# EAGLE design Schematc automa contatore (EAGLE 9.6.2)
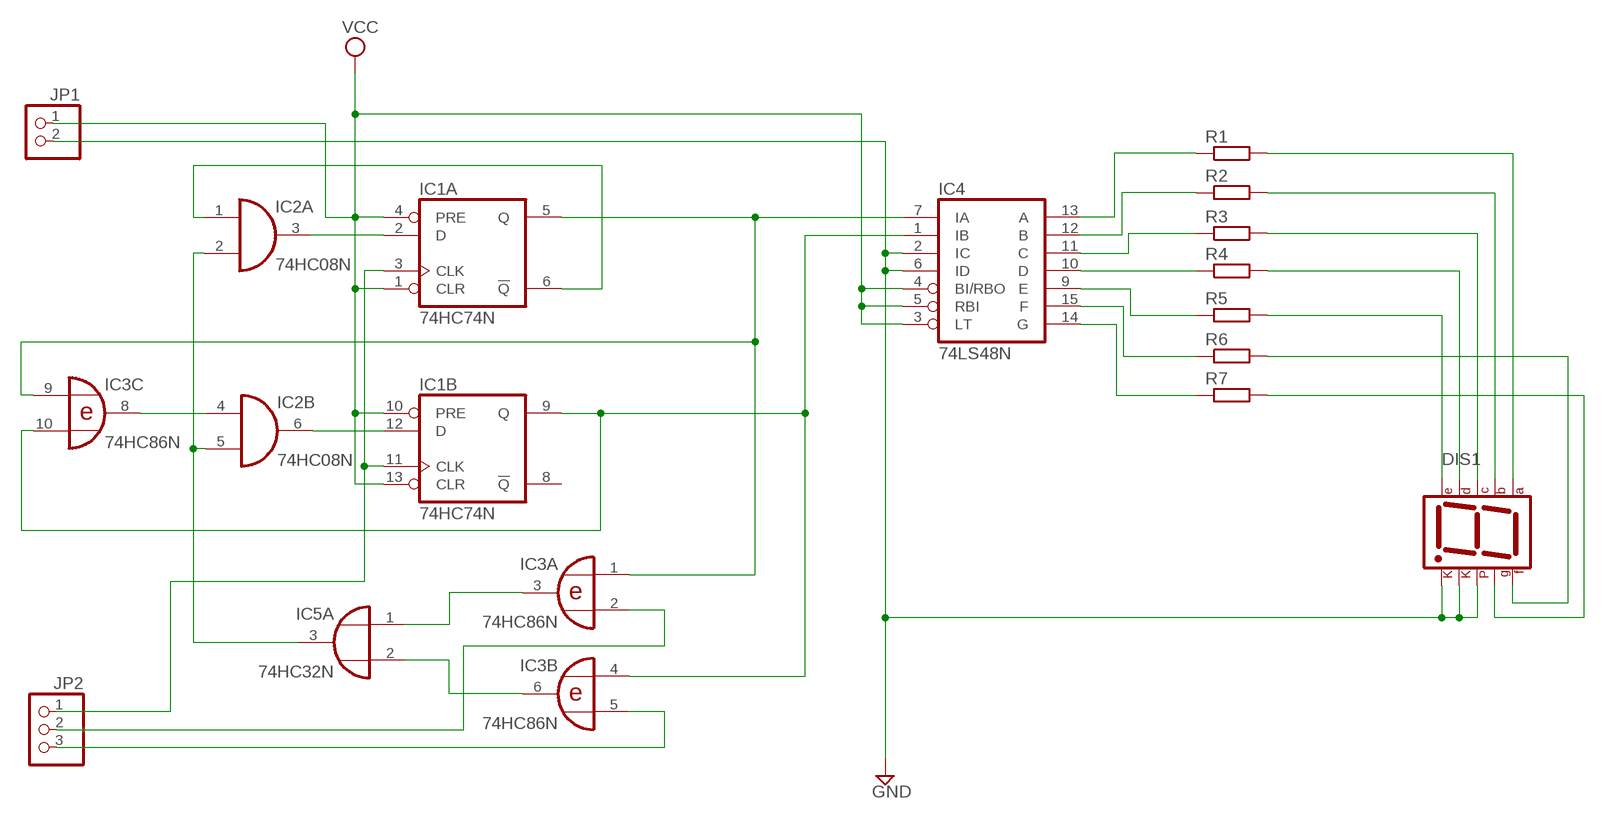
[diagram p0: schematic, sheet 1]

## Parts
DIS1  7SEG-CK  [7SEG-13]
IC1  74HC74N  [DIL14]
IC2  74HC08N  [DIL14]
IC3  74HC86N  [DIL14]
IC4  74LS48N  [DIL16]
IC5  74HC32N  [DIL14]
JP1  PINHD-1X2  [1X02]
JP2  PINHD-1X3  [1X03]
R1  R-EU_0204/5  [0204/5]
R2  R-EU_0204/5  [0204/5]
R3  R-EU_0204/5  [0204/5]
R4  R-EU_0204/5  [0204/5]
R5  R-EU_0204/5  [0204/5]
R6  R-EU_0204/5  [0204/5]
R7  R-EU_0204/5  [0204/5]

## Nets
GND: DIS1.3(CK1) DIS1.5(DP) DIS1.8(CK2) IC4.2(IC) IC4.6(ID) JP1.2
N$1: IC1.5(A:Q) IC3.1(A:I0) IC3.9(C:I0) IC4.7(IA)
N$2: IC1.9(B:Q) IC3.4(B:I0) IC3.10(C:I1) IC4.1(IB)
N$3: IC1.2(A:D) IC2.3(A:O)
N$4: IC1.12(B:D) IC2.6(B:O)
N$5: IC1.6(A:!Q) IC2.1(A:I0)
N$6: IC2.4(B:I0) IC3.8(C:O)
N$7: IC3.3(A:O) IC5.1(A:I0)
N$8: IC3.6(B:O) IC5.2(A:I1)
N$9: IC2.2(A:I1) IC2.5(B:I1) IC5.3(A:O)
N$10: IC1.3(A:CLK) IC1.11(B:CLK) JP2.1
N$11: IC3.2(A:I1) JP2.2
N$12: IC3.5(B:I1) JP2.3
N$13: IC4.13(A) R1.1
N$14: IC4.12(B) R2.1
N$15: IC4.11(C) R3.1
N$16: IC4.10(D) R4.1
N$17: IC4.9(E) R5.1
N$18: IC4.15(F) R6.1
N$19: IC4.14(G) R7.1
N$20: DIS1.7(A) R1.2
N$21: DIS1.6(B) R2.2
N$22: DIS1.4(C) R3.2
N$23: DIS1.2(D) R4.2
N$24: DIS1.1(E) R5.2
N$25: DIS1.9(F) R6.2
N$26: DIS1.10(G) R7.2
VCC: IC1.1(A:CLR) IC1.4(A:PRE) IC1.10(B:PRE) IC1.13(B:CLR) IC4.3(LT) IC4.4(BI/RBO) IC4.5(RBI) JP1.1
Unconnected: IC1.8(B:!Q) IC2.8(C:O) IC2.9(C:I0) IC2.10(C:I1) IC2.11(D:O) IC2.12(D:I0) IC2.13(D:I1) IC3.11(D:O) IC3.12(D:I0) IC3.13(D:I1) IC5.4(B:I0) IC5.5(B:I1) IC5.6(B:O) IC5.8(C:O) IC5.9(C:I0) IC5.10(C:I1) IC5.11(D:O) IC5.12(D:I0) IC5.13(D:I1)

## Power pins joined to a net without a drawn wire
GND: IC1.7(P:GND) IC2.7(P:GND) IC3.7(P:GND) IC4.8(GND) IC5.7(P:GND)
VCC: IC1.14(P:VCC) IC2.14(P:VCC) IC3.14(P:VCC) IC4.16(VCC) IC5.14(P:VCC)

## Library data of the parts
DIS1 = special:7SEG-CK: 7-segment DISPLAY single cathode, 13 mm
IC1 = 74xx-eu:74*74: Dual D type positive edge triggered FLIP FLOP, preset and clear
IC2 = 74xx-eu:74*08: Quad 2-input AND gate
IC3 = 74xx-eu:74*86: Quad 2-input EXCLUSIVE-OR (XOR) gate
IC4 = 74xx-eu:74*48: BCD to seven segment DECODER/DRIVER
IC5 = 74xx-eu:74*32: Quad 2-input OR gate
JP1 = pinhead:PINHD-1X2: PIN HEADER
JP2 = pinhead:PINHD-1X3: PIN HEADER
R1-R7 = rcl:R-EU_: RESISTOR, European symbol; SPICEPREFIX: R

## Board
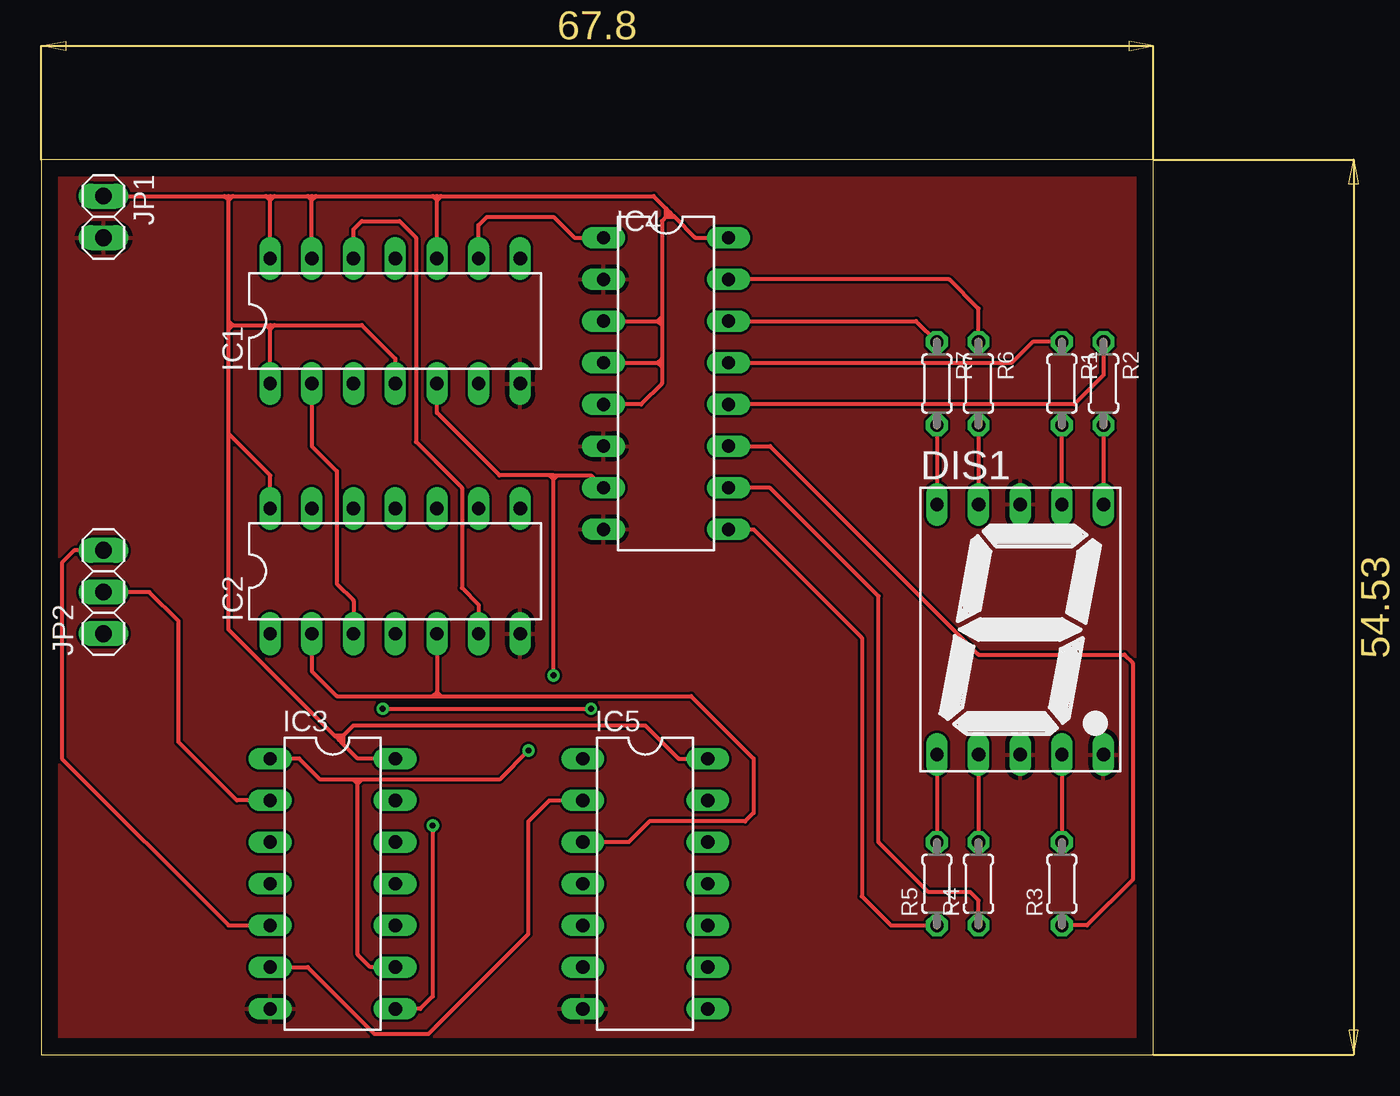
[diagram p1: board, top side]
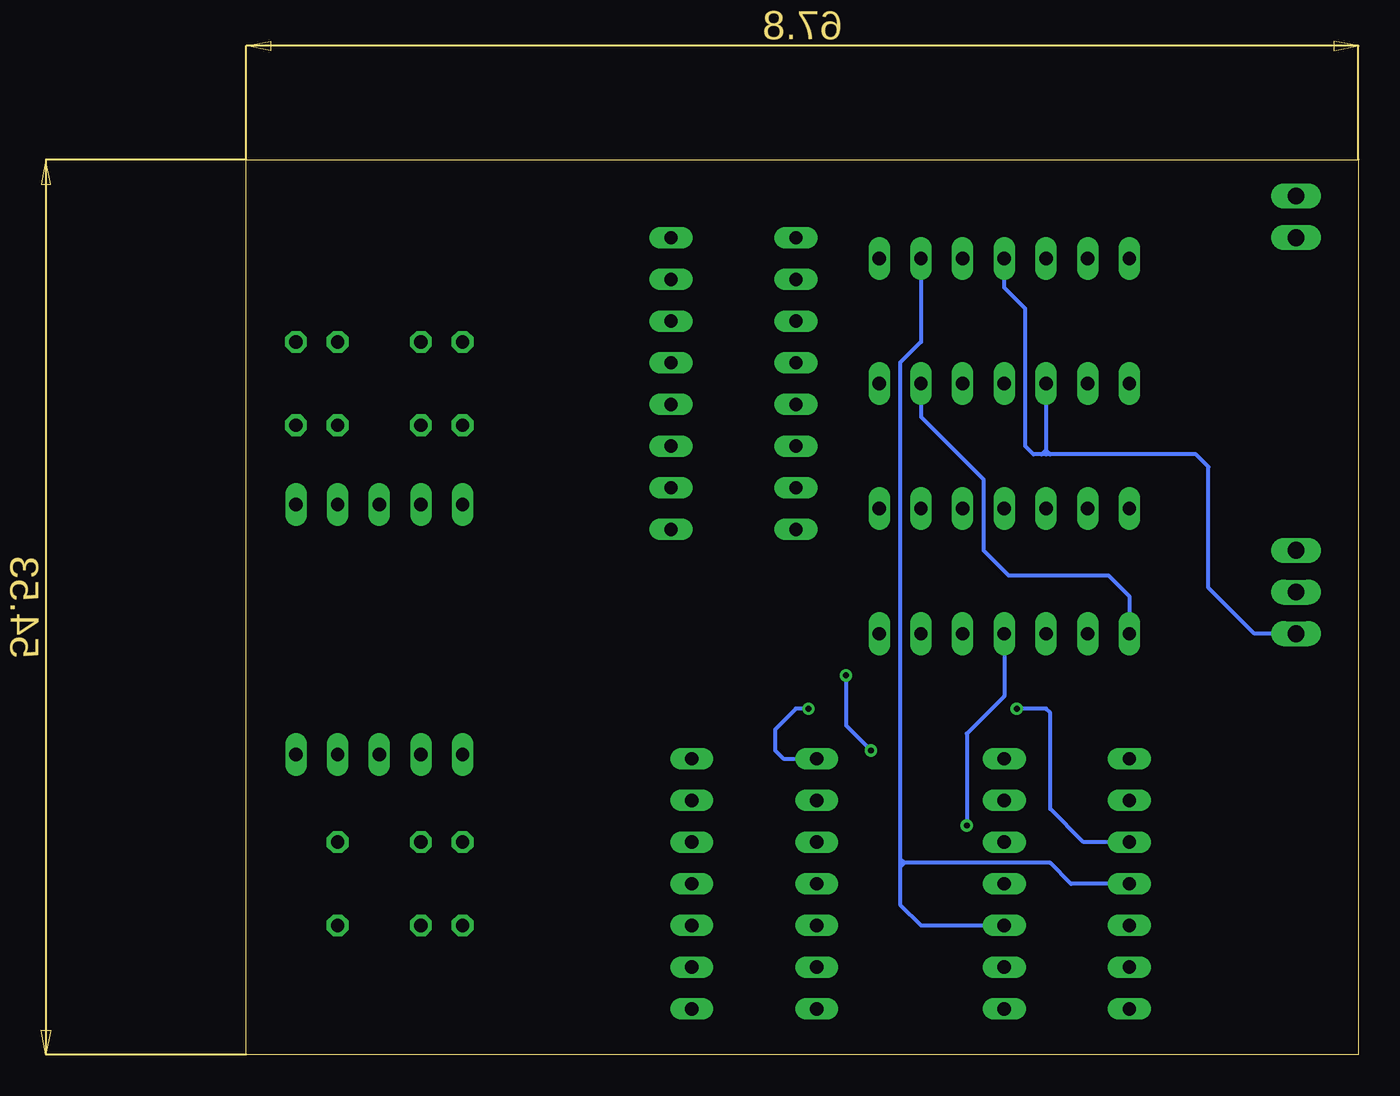
[diagram p2: board, bottom side, seen from below]

Size 67.8 x 54.53 mm. Coordinates in mm from the lower left corner, seen from the top.
Outline: 0,0 67.8,0 67.8,54.53 0,54.53 0,0
Copper layers (1*16): Top 0.035mm / dielectric 1.5mm / Bottom 0.035mm
Design rules "default": minimum track width 6mil, minimum drill 0.35mm, track to track 6mil, track to pad 6mil, pad to pad 6mil, via to via 6mil, smd to smd 6mil, copper to edge 40mil, drill to drill 6mil, minimum pad ring 10mil, minimum via ring 8mil, stop-mask expansion 4mil, vias tented up to drill 0mil, thermal gap 10mil

### Footprints (pad centres in the part's own frame; a part is rotated, then mirrored left to right if it is on the bottom)
7SEG-13 = drill 0.813 long: 1 -5.08,-7.62; 2 -2.54,-7.62; 3 0,-7.62; 4 2.54,-7.62; 5 5.08,-7.62; 6 5.08,7.62; 7 2.54,7.62; 8 0,7.62; 9 -2.54,7.62; 10 -5.08,7.62
DIL14 = drill 0.813 long: 1 -7.62,-3.81; 2 -5.08,-3.81; 3 -2.54,-3.81; 4 0,-3.81; 5 2.54,-3.81; 6 5.08,-3.81; 7 7.62,-3.81; 8 7.62,3.81; 9 5.08,3.81; 10 2.54,3.81; 11 0,3.81; 12 -2.54,3.81; 13 -5.08,3.81; 14 -7.62,3.81
DIL16 = drill 0.813 long: 1 -8.89,-3.81; 2 -6.35,-3.81; 3 -3.81,-3.81; 4 -1.27,-3.81; 5 1.27,-3.81; 6 3.81,-3.81; 7 6.35,-3.81; 8 8.89,-3.81; 9 8.89,3.81; 10 6.35,3.81; 11 3.81,3.81; 12 1.27,3.81; 13 -1.27,3.81; 14 -3.81,3.81; 15 -6.35,3.81; 16 -8.89,3.81
1X02 = drill 1.016 long: 1 -1.27,0; 2 1.27,0
1X03 = drill 1.016 long: 1 -2.54,0; 2 0,0; 3 2.54,0
0204/5 = drill 0.813 octagon: 1 -2.54,0; 2 2.54,0

### Placement (x,y rotation side)
DIS1  59.69,25.91 0 top
IC1  21.59,44.7 0 top
IC2  21.59,29.46 0 top
IC3  17.78,10.41 270 top
IC4  38.1,40.89 270 top
IC5  36.83,10.41 270 top
JP1  3.81,51.05 270 top
JP2  3.81,28.19 90 top
R1  62.23,40.89 270 top
R2  64.77,40.89 270 top
R3  62.23,10.41 90 top
R4  57.15,10.41 90 top
R5  54.61,10.41 90 top
R6  57.15,40.89 270 top
R7  54.61,40.89 270 top

### Tracks (layer width: path | path; a pad name or v marks a point on that pad's centre or on a via)
GND
  pour Top: -1.02,55.37 -1.02,-1.27 69.09,-1.27 69.09,55.37
N$1  (via drill 0.35)
  Top 0.254: 31.24,35.31 30.99,35.31 | 30.99,35.31 27.94,35.31 24.13,39.12 IC1.5 | v31.24,23.11 31.24,35.05 | 31.24,35.31 31.24,35.05 | v29.72,18.54 27.94,16.76 19.56,16.76 | IC3.1 15.75,18.03 17.02,16.76 19.05,16.76 | 19.56,16.76 19.3,16.76 | 19.3,16.76 19.05,16.76 | IC3.9 20.07,5.33 19.3,6.1 19.3,16.51 | 19.3,16.51 19.3,16.76 | 31.24,35.31 31.5,35.31 | 31.5,35.31 33.53,35.31 IC4.7 | 31.24,35.05 30.99,35.31 | 31.24,35.05 31.5,35.31 | 19.3,16.51 19.05,16.76 | 19.3,16.51 19.56,16.76
  Bottom 0.254: v31.24,23.11 31.24,20.07 v29.72,18.54
N$2
  Top 0.254: IC1.9 26.67,50.55 27.18,51.05 31.24,51.05 32.51,49.78 IC4.1
  Bottom 0.254: IC1.9 26.67,43.43 27.94,42.16 27.94,11.94 | 27.94,11.94 27.94,11.68 | 27.94,11.68 27.94,11.43 | 27.94,11.43 27.94,9.14 26.67,7.87 IC3.10 | IC3.4 17.53,10.41 18.8,11.68 27.69,11.68 | 27.94,11.68 27.69,11.68 | 27.69,11.68 27.94,11.43 | 27.69,11.68 27.94,11.94
N$3
  Top 0.254: IC2.3 19.05,27.69 18.03,28.7 18.03,35.56 16.51,37.08 IC1.2
N$4
  Top 0.254: IC1.12 19.05,50.29 19.56,50.8 21.84,50.8 22.86,49.78 22.86,37.34 25.65,34.54 25.65,28.45 26.67,27.43 IC2.6
N$5
  Bottom 0.254: IC1.6 26.67,38.86 22.86,35.05 22.86,30.73 21.34,29.21 15.24,29.21 13.97,27.94 IC2.1
N$6  (via drill 0.35)
  Top 0.254: v23.88,13.97 23.88,3.56 23.11,2.79 IC3.8
  Bottom 0.254: v23.88,13.97 23.88,19.56 21.59,21.84 IC2.4
N$7  (via drill 0.35)
  Top 0.254: v20.83,21.08 v33.53,21.08
  Bottom 0.254: IC3.3 16.76,12.95 18.8,14.99 18.8,20.83 19.05,21.08 v20.83,21.08 | v33.53,21.08 34.29,21.08 35.56,19.81 35.56,18.54 35.05,18.03 IC5.1
N$8
  Top 0.254: IC3.6 16.26,5.33 20.32,1.27 23.62,1.27 29.72,7.37 29.72,14.22 30.99,15.49 IC5.2
N$9
  Top 0.254: IC2.2 16.51,23.37 18.03,21.84 23.88,21.84 | IC5.3 35.81,12.95 37.08,14.22 42.93,14.22 43.43,14.73 43.43,18.03 39.62,21.84 24.38,21.84 | 23.88,21.84 24.13,21.84 | 24.13,21.84 24.38,21.84 | IC2.5 24.13,22.1 | 24.13,21.84 24.13,22.1 | 24.13,22.1 23.88,21.84 | 24.13,22.1 24.38,21.84
N$10
  Bottom 0.254: JP2.1 6.35,25.65 9.14,28.45 9.14,35.81 9.91,36.58 18.8,36.58 | 19.05,36.58 19.05,36.83 | IC1.3 19.05,36.83 | 18.8,36.58 19.05,36.58 | 19.05,36.58 19.3,36.58 | 19.3,36.58 19.81,36.58 20.32,37.08 20.32,45.47 21.59,46.74 IC1.11 | 19.05,36.83 18.8,36.58 | 19.05,36.83 19.3,36.58
N$11
  Top 0.254: IC3.2 11.94,15.49 8.38,19.05 8.38,26.42 6.6,28.19 JP2.2
N$12
  Top 0.254: JP2.3 2.03,30.73 1.27,29.97 1.27,18.03 11.43,7.87 IC3.5
N$13
  Top 0.254: IC4.13 59.18,42.16 60.45,43.43 R1.1
N$14
  Top 0.254: R2.1 64.77,41.4 62.99,39.62 IC4.12
N$15
  Top 0.254: IC4.11 44.45,37.08 57.15,24.38 66.04,24.38 66.55,23.88 66.55,10.67 63.75,7.87 R3.1
N$16
  Top 0.254: R4.1 57.15,9.4 56.64,9.91 54.1,9.91 51.05,12.95 51.05,27.94 44.45,34.54 IC4.10
N$17
  Top 0.254: R5.1 51.82,7.87 50.04,9.65 50.04,25.4 43.43,32 IC4.9
N$18
  Top 0.254: R6.1 57.15,45.47 55.37,47.24 IC4.15
N$19
  Top 0.254: IC4.14 53.34,44.7 R7.1
N$20
  Top 0.254: DIS1.7 R1.2
N$21
  Top 0.254: R2.2 DIS1.6
N$22
  Top 0.254: DIS1.4 R3.2
N$23
  Top 0.254: DIS1.2 R4.2
N$24
  Top 0.254: DIS1.1 R5.2
N$25
  Top 0.254: R6.2 DIS1.9
N$26
  Top 0.254: R7.2 DIS1.10
VCC
  Top 0.254: JP1.1 11.18,52.32 | 11.18,52.32 11.43,52.32 | 11.43,52.32 11.68,52.32 | 11.68,52.32 13.72,52.32 | 13.72,52.32 13.97,52.32 | 13.97,52.32 14.22,52.32 | 14.22,52.32 16.26,52.32 | 16.26,52.32 16.51,52.32 | 16.51,52.32 16.76,52.32 | 16.76,52.32 23.88,52.32 | 23.88,52.32 24.13,52.32 | 24.13,52.32 24.38,52.32 | 24.38,52.32 37.34,52.32 38.1,51.56 | 38.1,51.56 38.35,51.31 | 38.35,51.31 38.61,51.05 | 38.61,51.05 39.88,49.78 IC4.16 | IC1.14 13.97,52.07 | 13.97,52.32 13.97,52.07 | IC1.13 16.51,52.07 | 16.51,52.32 16.51,52.07 | IC1.10 24.13,52.07 | 24.13,52.32 24.13,52.07 | 11.43,44.45 11.43,44.7 | 11.43,44.7 11.43,52.07 | 11.43,52.32 11.43,52.07 | IC2.14 13.97,35.31 11.43,37.85 | 11.43,37.85 11.43,44.2 | 11.43,44.2 11.43,44.45 | 11.43,44.45 11.68,44.45 | 11.68,44.45 13.72,44.45 | 13.72,44.45 13.97,44.45 | 13.97,44.45 13.97,44.2 | IC1.1 13.97,44.2 | IC3.14 19.3,18.03 18.41,18.92 | 18.41,18.92 18.16,19.18 | 18.16,19.18 17.91,19.43 | 17.91,19.43 11.43,25.91 11.43,37.85 | 18.16,19.18 18.41,19.43 | 18.41,19.43 19.05,20.07 36.83,20.07 38.86,18.03 IC5.14 | 13.97,44.45 14.22,44.45 | 14.22,44.45 19.56,44.45 21.59,42.42 IC1.4 | 11.43,52.07 11.68,52.32 | 11.43,52.07 11.18,52.32 | 13.97,52.07 13.72,52.32 | 13.97,52.07 14.22,52.32 | 16.51,52.07 16.26,52.32 | 16.51,52.07 16.76,52.32 | 24.13,52.07 23.88,52.32 | 24.13,52.07 24.38,52.32 | 11.68,44.45 11.43,44.7 | 11.68,44.45 11.43,44.2 | 13.97,44.2 13.72,44.45 | 13.97,44.2 14.22,44.45 | 18.41,19.43 18.41,18.92 | 18.41,19.43 17.91,19.43 | 38.1,51.05 37.85,50.8 37.85,44.96 | 38.35,51.31 38.1,51.05 | 38.1,51.05 38.61,51.05 | 38.1,51.05 38.1,51.56 | IC4.5 36.58,39.62 37.85,40.89 37.85,41.91 | 37.85,44.96 37.85,44.7 | 37.85,44.7 37.85,44.45
  Top 0.254: 37.85,44.45 37.85,42.42 | 37.85,42.42 37.85,42.16 | 37.85,42.16 37.85,41.91 | IC4.4 37.59,42.16 | 37.85,42.16 37.59,42.16 | IC4.3 37.59,44.7 | 37.59,44.7 37.85,44.7 | 37.85,44.96 37.59,44.7 | 37.59,44.7 37.85,44.45 | 37.59,42.16 37.85,42.42 | 37.59,42.16 37.85,41.91